# Altium schematic sheet CCP_MCU.SchDoc
size A
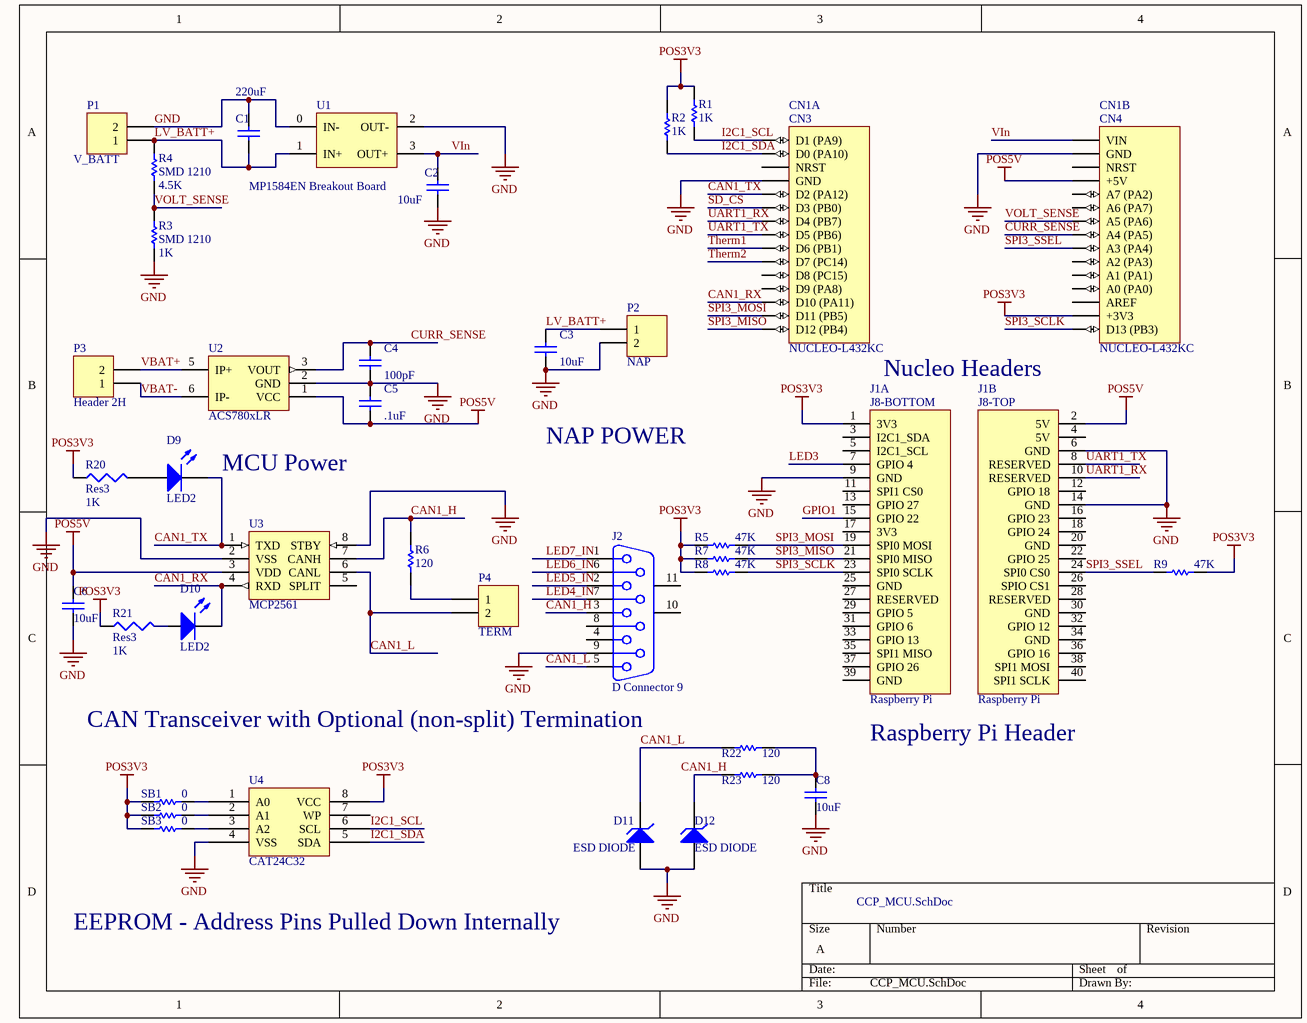
[diagram p0: CCP_MCU.SchDoc]

## Parts
C1  value 220uF  [CAPR5-4X5]  (hidden comment: Cap)
C2  value 10uF  [C1206]  (hidden comment: Cap)
C3  value 10uF  [C1206]  (hidden comment: Cap)
C4  value 100pF  [1608[0603]]  (hidden comment: Cap Semi)
C5  value .1uF  [C1206]  (hidden comment: Cap Semi)
C6  value 10uF  [C1206]  (hidden comment: Cap)
C8  value 10uF  [C1206]  (hidden comment: Cap)
CN1  NUCLEO-L432KC  [NUCLEO-32]  (parts A,B of 2)
D9  LED2  [3.2X1.6X1.1]
D10  LED2  [3.2X1.6X1.1]
D11  ESD DIODE  [6-0805_M]
D12  ESD DIODE  [6-0805_M]
J1  Raspberry Pi  [Raspberry Pi - CCP Outline]  (parts A,B of 2)
J2  D Connector 9  [DSUB1.385-2H9]
P1  V_BATT  [2POS TERM BLOCK]
P2  NAP  [2POS TERM BLOCK]
P3  Header 2H  [2POS TERM BLOCK]
P4  TERM  [HDR1X2]
R1  value 1K  [6-0805_M]  (hidden comment: Res1)
R2  value 1K  [6-0805_M]  (hidden comment: Res1)
R3  SMD 1210  value 1K  [14-1210]
R4  SMD 1210  value 4.5K  [14-1210]
R5  value 47K  [6-0805_M]  (hidden comment: Res1)
R6  value 120  [6-0805_M]  (hidden comment: Res1)
R7  value 47K  [6-0805_M]  (hidden comment: Res1)
R8  value 47K  [6-0805_M]  (hidden comment: Res1)
R9  value 47K  [6-0805_M]  (hidden comment: Res1)
R20  Res3  value 1K  [J1-0603]
R21  Res3  value 1K  [J1-0603]
R22  value 120  [6-0805_M]  (hidden comment: Res1)
R23  value 120  [6-0805_M]  (hidden comment: Res1)
SB1  value 0  [6-0805_M]  (hidden comment: Res1)
SB2  value 0  [6-0805_M]  (hidden comment: Res1)
SB3  value 0  [6-0805_M]  (hidden comment: Res1)
U1  MP1584EN Breakout Board  [MP1584EN Breakout]
U2  ACS780xLR  [7-pin PSOF]
U3  MCP2561  [SO8_L]
U4  CAT24C32  [SO8_N]

## Nets
GND: C1.2 C2.1 C3.1 C4.1 C5.2 C6.1 C8.1 CN1.4(GND) CN1.29(GND) D11.1(A) D12.1(A) J1.6(GND) J1.9(GND) J1.14(GND) J2.9 P1.2 P2.2 R3.2 U1.0(IN-) U1.2(OUT-) U2.2(GND) U3.2(VSS) U3.8(STBY) U4.4(VSS)
POS3V3: CN1.17(+3V3) J1.1(3V3) R1.2 R2.2 R5.1 R7.1 R8.1 R9.2 R20.1 R21.1 SB1.2 SB2.2 SB3.2 U4.8(VCC)
POS5V: C5.1 C6.2 CN1.27(+5V) J1.2(5V) U2.1(VCC) U3.3(VDD)
CAN1_H: J2.3 R6.2 U3.7(CANH)
CAN1_L: D11.2(K) J2.5 P4.2 R22.2 U3.6(CANL)
CAN1_RX: CN1.13(D10_(PA11)) D10.2(K) U3.4(RXD)
CAN1_TX: CN1.5(D2_(PA12)) D9.2(K) U3.1(TXD)
CURR_SENSE: C4.2 CN1.23(A4_(PA5)) U2.3(VOUT)
GPIO1: J1.15(GPIO_22)
I2C1_SCL: CN1.1(D1_(PA9)) R1.1 U4.6(SCL)
I2C1_SDA: CN1.2(D0_(PA10)) R2.1 U4.5(SDA)
LED3: J1.7(GPIO_4)
LED4_IN: J2.7
LED5_IN: J2.2
LED6_IN: J2.6
LED7_IN: J2.1
LV_BATT+: C1.1 C3.2 P1.1 P2.1 R4.1 U1.1(IN+)
SD_CS: CN1.6(D3_(PB0))
SPI3_MISO: CN1.15(D12_(PB4)) J1.21(SPI0_MISO) R7.2
SPI3_MOSI: CN1.14(D11_(PB5)) J1.19(SPI0_MOSI) R5.2
SPI3_SCLK: CN1.16(D13_(PB3)) J1.23(SPI0_SCLK) R8.2
SPI3_SSEL: CN1.22(A3_(PA4)) J1.24(SPI0_CS0) R9.1
Therm1: CN1.9(D6_(PB1))
Therm2: CN1.10(D7_(PC14))
UART1_RX: CN1.7(D4_(PB7)) J1.10(RESERVED)
UART1_TX: CN1.8(D5_(PB6)) J1.8(RESERVED)
VBAT+: P3.2 U2.5(IP+)
VBAT-: P3.1 U2.6(IP-)
VIn: C2.2 CN1.30(VIN) U1.3(OUT+)
VOLT_SENSE: CN1.24(A5_(PA6)) R3.1 R4.2
NetC8_2: C8.2 R22.1 R23.1
NetD9_1: D9.1(A) R20.2
NetD10_1: D10.1(A) R21.2
NetD12_2: D12.2(K) R23.2
NetP4_1: P4.1 R6.1
NetSB1_1: SB1.1 U4.1(A0)
NetSB2_1: SB2.1 U4.2(A1)
NetSB3_1: SB3.1 U4.3(A2)

Not connected (* = marked no-connect by the designer): CN1 3(NRST) 11(D8_(PC15)) 12(D9_(PA8)) 18(AREF) 19(A0_(PA0)) 20(A1_(PA1)) 21(A2_(PA3)) 25(A6_(PA7)) 26(A7_(PA2)) 28(NRST); J1 3(I2C1_SDA) 4(5V) 5(I2C1_SCL) 11(SPI1_CS0) 12(GPIO_18) 13(GPIO_27) 16(GPIO_23) 17(3V3) 18(GPIO_24) 20(GND) 22(GPIO_25) 25(GND) 26(SPIO_CS1) 27(RESERVED) 28(RESERVED) 29(GPIO_5) 30(GND) 31(GPIO_6) 32(GPIO_12) 33(GPIO_13) 34(GND) 35(SPI1_MISO) 36(GPIO_16) 37(GPIO_26) 38(SPI1_MOSI) 39(GND) 40(SPI1_SCLK); J2 4 8 10(MH1) 11(MH2); U3 5(SPLIT); U4 7(WP)

## Notes on the sheet
- (near J1) Nucleo Headers
- MCU Power
- NAP POWER
- (near R22) CAN Transceiver with Optional (non-split) Termination
- (near J1) Raspberry Pi Header
- CCP_MCU.SchDoc
- EEPROM - Address Pins Pulled Down Internally
- Labels drawn without touching a wire or pin: CAN1_H
- (in symbol NUCLEO-L432KC, part A) CN3
- (in symbol NUCLEO-L432KC, part B) CN4
- (in symbol Raspberry Pi, part A) J8-BOTTOM
- (in symbol Raspberry Pi, part B) J8-TOP

## Library data of the parts
C1-C3 C6 C8 = Cap: Capacitor; Published: 8-Jun-2000; LatestRevisionDate: 17-Jul-2002; LatestRevisionNote: Re-released for DXP Platform.; PackageReference: RAD-0.3; Publisher: Altium Limited; PackageDescription: Radial Cap, Thru-Hole; 2 Leads; 0.3 in Pin Spacing
C4 C5 = Cap Semi: Capacitor (Semiconductor SIM Model); Published: 8-Jun-2000; LatestRevisionDate: 29-May-2009; LatestRevisionNote: IPC-7351 Footprint Added.; PackageReference: C1206; Publisher: Altium Limited; PackageDescription: Chip Capacitor
CN1 = NUCLEO-L432KC: STM32L432KC Development Board; ComponentLink1Description: MBED; ComponentLink1URL: https://os.mbed.com/platforms/ST-Nucleo-L432KC/; ComponentLink2Description: Digikey; ComponentLink2URL: https://www.digikey.com/products/en?keywords=NUCLEO-L432KC
D9 D10 = LED2: Typical RED, GREEN, YELLOW, AMBER GaAs LED; Published: 8-Jun-2000; LatestRevisionDate: 17-Jul-2002; LatestRevisionNote: Re-released for DXP Platform.; PackageVersion: Feb-2002; PackageReference: 3.2X1.6X1.1; Publisher: Altium Limited; PackageDescription: SM LED; 2 Flat Leads
D11 D12 = D Zener: Zener Diode; Published: 8-Jun-2000; LatestRevisionDate: 17-Jul-2002; LatestRevisionNote: Re-released for DXP Platform.; PackageReference: DIODE-0.7; Publisher: Altium Limited; PackageDescription: Diode, Thru-Hole; 2 Leads; 0.7 in Pin Spacing
J1 = Raspberry Pi: 2x20 Header
J2 = D Connector 9: Receptacle Assembly, 9 Position, Right Angle; PackageDocument: O; Positions: 9; Published: 15-Jun-2001; LatestRevisionDate: 17-Jul-2002; LatestRevisionNote: Re-released for DXP Platform.; DatasheetDocument: 1-Sep-1999; PackageReference: 788750; Publisher: Altium Limited; Orientation: Right Angle; Gender: Receptacle
P1 P2 P4 = Header 2: Header, 2-Pin; LatestRevisionDate: 17-Jul-2002; LatestRevisionNote: Re-released for DXP Platform.; Publisher: Altium Limited
P3 = Header 2H: Header, 2-Pin, Right Angle; LatestRevisionDate: 17-Jul-2002; LatestRevisionNote: Re-released for DXP Platform.; Publisher: Altium Limited
R1-R9 R22 R23 SB1-SB3 = Res1: Resistor; Published: 8-Jun-2000; LatestRevisionDate: 17-Jul-2002; LatestRevisionNote: Re-released for DXP Platform.; PackageReference: AXIAL-0.3; Publisher: Altium Limited; PackageDescription: Axial Device, Thru-Hole; 2 Leads; 0.3 in Pin Spacing
R20 R21 = Res3: Resistor; Published: 8-Jun-2000; LatestRevisionDate: 29-May-2009; LatestRevisionNote: IPC-7351 Footprint Added.; PackageReference: J1-0603; Publisher: Altium Limited; PackageDescription: Chip Resistor
U1 = MP1584EN Breakout Board: Buck Converter; ComponentLink1Description: Part; ComponentLink1URL: https://www.amazon.com/eBoot-MP1584EN-Converter-Adjustable-Module/dp/B01MQGMOKI/
U2 = ACS780xLR: Hall-Effect Current Sensor; ComponentLink1Description: Part; ComponentLink1URL: https://www.digikey.com/product-detail/en/allegro-microsystems-llc/ACS780LLRTR-050B-T/620-1817-1-ND/6189106
U3 = MCP2561: CAN Transciever; ComponentLink1Description: Part; ComponentLink1URL: https://www.digikey.com/product-detail/en/microchip-technology/MCP2561-E-SN/MCP2561-E-SN-ND/4079961; ComponentLink2Description: Datasheet; ComponentLink2URL: http://ww1.microchip.com/downloads/en/DeviceDoc/20005167C.pdf
U4 = CAT24C32: I2C EEPROM; ComponentLink1Description: Part; ComponentLink1URL: https://www.digikey.com/product-detail/en/on-semiconductor/CAT24C32WI-GT3/CAT24C32WI-GT3CT-ND/1631159; ComponentLink2Description: Datasheet; ComponentLink2URL: http://www.onsemi.com/pub/Collateral/CAT24C32-D.PDF